# Altium project MAX262.PrjPcb
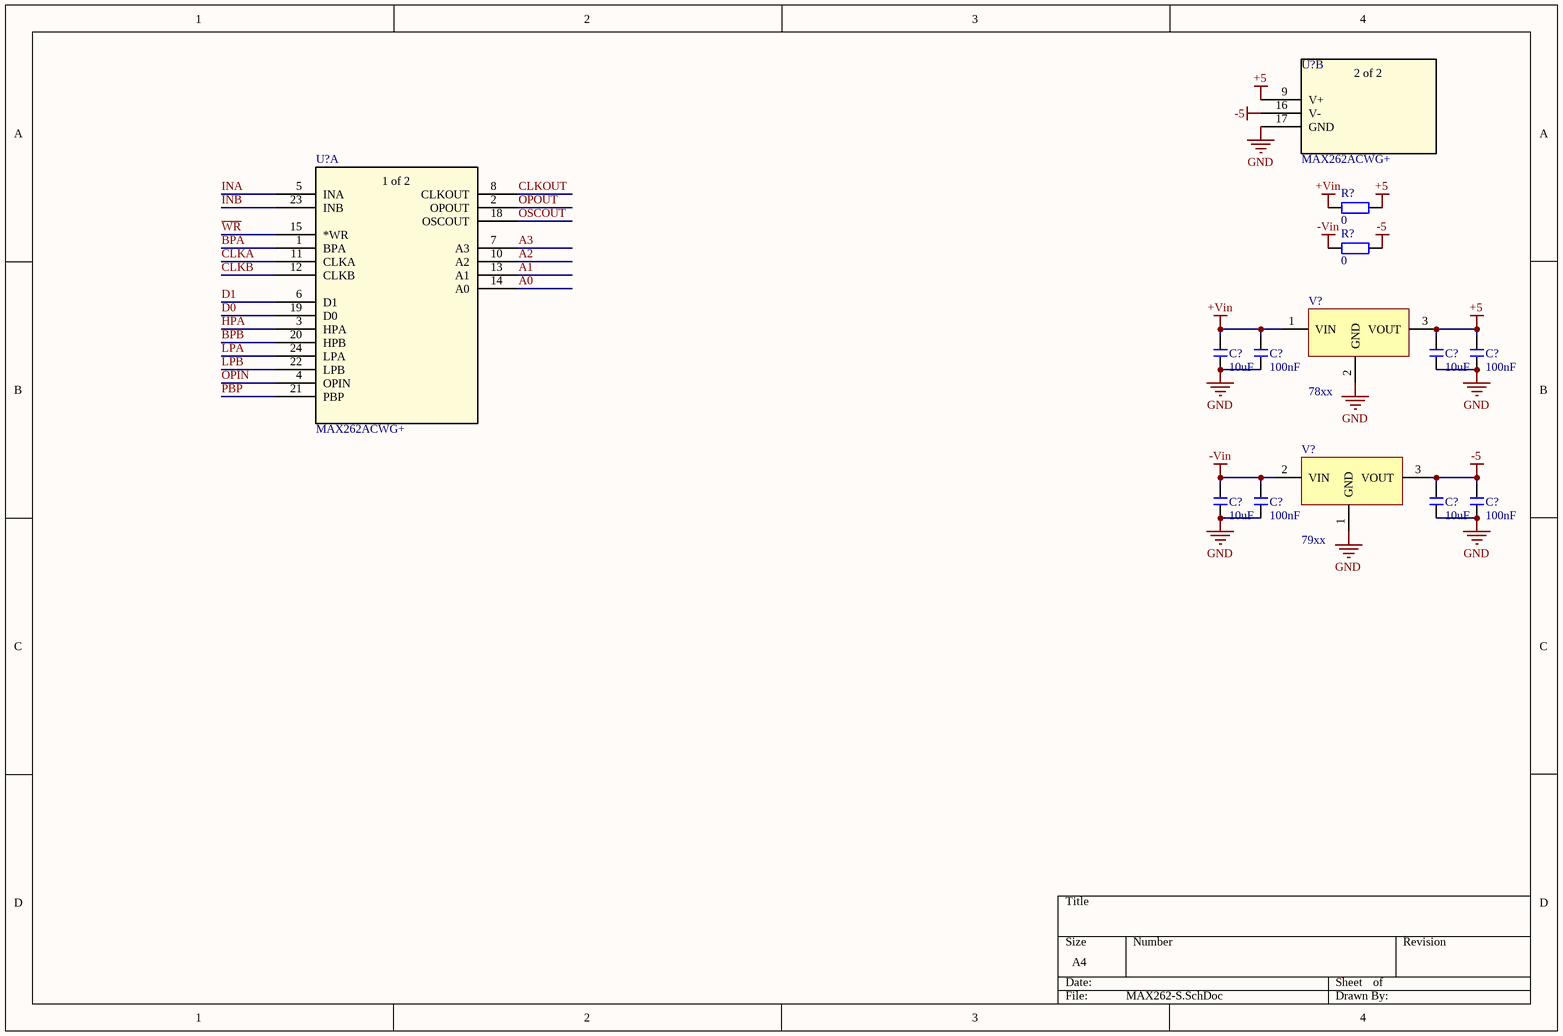
[diagram p0: MAX262-S.SchDoc]
1 sheet, 14 parts. Net scope: global (net labels, ports and power ports of the same name join across sheets).
Board file: MAX262-P.PcbDoc

## Sheet MAX262-S.SchDoc
size A4; SheetNumber: 1; SheetTotal: 1

### Parts
(Parts that share a designator on the sheet are numbered #1, #2 ... from top to bottom, then left to right.)
C?#1  10uF  [C 0603_L]
C?#2  100nF  [C 0603_L]
C?#3  10uF  [C 0603_L]
C?#4  100nF  [C 0603_L]
C?#5  10uF  [C 0603_L]
C?#6  100nF  [C 0603_L]
C?#7  10uF  [C 0603_L]
C?#8  100nF  [C 0603_L]
R?#1  0  [R 0805_L]
R?#2  0  [R 0805_L]
U?#1  MAX262ACWG+  [21-0042B_24_MXM]  (part B of 2)
U?#2  MAX262ACWG+  [21-0042B_24_MXM]  (part A of 2)
V?#1  78xx  [TO252]
V?#2  79xx  [TO252]

### Nets
+5: C?#3.2 C?#4.2 R?#1.2 U?#1.9(V+) V?#1.3(VOUT)
+Vin: C?#1.2 C?#2.2 R?#1.1 V?#1.1(VIN)
-5: C?#7.2 C?#8.2 R?#2.2 U?#1.16(V-) V?#2.3(VOUT)
-Vin: C?#5.2 C?#6.2 R?#2.1 V?#2.2(VIN)
GND: C?#1.1 C?#2.1 C?#3.1 C?#4.1 C?#5.1 C?#6.1 C?#7.1 C?#8.1 U?#1.17(GND) V?#1.2(GND) V?#2.1(GND)
~{WR}: U?#2.15(*WR)
A0: U?#2.14(A0)
A1: U?#2.13(A1)
A2: U?#2.10(A2)
A3: U?#2.7(A3)
BPA: U?#2.1(BPA)
BPB: U?#2.20(HPB)
CLKA: U?#2.11(CLKA)
CLKB: U?#2.12(CLKB)
CLKOUT: U?#2.8(CLKOUT)
D0: U?#2.19(D0)
D1: U?#2.6(D1)
HPA: U?#2.3(HPA)
INA: U?#2.5(INA)
INB: U?#2.23(INB)
LPA: U?#2.24(LPA)
LPB: U?#2.22(LPB)
OPIN: U?#2.4(OPIN)
OPOUT: U?#2.2(OPOUT)
OSCOUT: U?#2.18(OSCOUT)
PBP: U?#2.21(PBP)

### Notes on the sheet
- (in symbol MAX262ACWG+, part A) 1 of 2
- (in symbol MAX262ACWG+, part B) 2 of 2

### Library data of the parts
C?#1-C?#8 = C: 无极性贴片电容; 版权归属: 源创客; BOM名称: 无极性贴片电容; 学习资源: www.ooocke.com
R?#1 R?#2 = R: 贴片电阻; 版权归属: 源创客; BOM名称: 贴片电阻; 学习资源: www.ooocke.com
U?#1 U?#2 = MAX262ACWG+: No Description Available; Mfr_Name: Maxim Integrated Products; Copyright: Copyright (C) 2022 Ultra Librarian. All rights reserved.; Manufacturer_Part_Number: MAX262ACWG+; RefDes: RefDes; Type: DEV
V?#1 = 78xx: 线性稳压芯片; 版权归属: 源创客; BOM名称: 线性稳压芯片; 学习资源: www.ooocke.com
V?#2 = 79xx: 线性稳压芯片; 版权归属: 源创客; BOM名称: 线性稳压芯片; 学习资源: www.ooocke.com